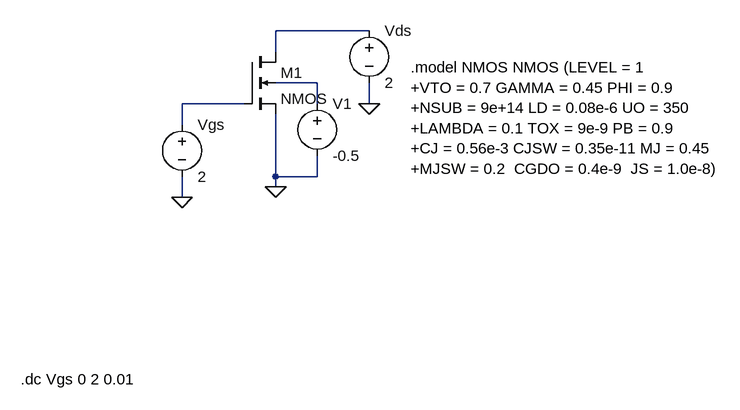
[diagram p0: schematic nmos load char.asc]
nmos load char.asc, the LTspice schematic file:
Version 4
SHEET 1 1212 744
WIRE 640 48 496 48
WIRE 496 80 496 48
WIRE 560 128 496 128
WIRE 448 160 352 160
WIRE 560 160 560 128
WIRE 640 160 640 128
WIRE 352 192 352 160
WIRE 496 272 496 176
WIRE 560 272 560 240
WIRE 560 272 496 272
WIRE 496 288 496 272
WIRE 352 304 352 272
FLAG 640 160 0
FLAG 496 288 0
FLAG 352 304 0
SYMBOL voltage 640 32 R0
WINDOW 123 0 0 Left 0
WINDOW 39 0 0 Left 0
SYMATTR InstName Vds
SYMATTR Value 2
SYMBOL voltage 352 176 R0
WINDOW 123 0 0 Left 0
WINDOW 39 0 0 Left 0
SYMATTR InstName Vgs
SYMATTR Value 2
SYMBOL nmos4 448 80 R0
SYMATTR InstName M1
SYMATTR Value2 l=200n w=200n
SYMBOL voltage 560 144 R0
WINDOW 123 0 0 Left 0
WINDOW 39 0 0 Left 0
SYMATTR InstName V1
SYMATTR Value -0.5
TEXT 104 584 Left 2 !.dc Vgs 0 2 0.01
TEXT 704 104 Left 2 !.model NMOS NMOS (LEVEL = 1 \n+VTO = 0.7 GAMMA = 0.45 PHI = 0.9\n+NSUB = 9e+14 LD = 0.08e-6 UO = 350 \n+LAMBDA = 0.1 TOX = 9e-9 PB = 0.9 \n+CJ = 0.56e-3 CJSW = 0.35e-11 MJ = 0.45 \n+MJSW = 0.2  CGDO = 0.4e-9  JS = 1.0e-8)

The netlist it stands for:
* nmos load char.asc
Vds N001 0 2
Vgs N003 0 2
M1 N001 N003 0 N002 NMOS l=200n w=200n
V1 N002 0 -0.5
.model NMOS NMOS
.model PMOS PMOS
.lib standard.mos
.dc Vgs 0 2 0.01
.model NMOS NMOS (LEVEL = 1
+VTO = 0.7 GAMMA = 0.45 PHI = 0.9
+NSUB = 9e+14 LD = 0.08e-6 UO = 350
+LAMBDA = 0.1 TOX = 9e-9 PB = 0.9
+CJ = 0.56e-3 CJSW = 0.35e-11 MJ = 0.45
+MJSW = 0.2  CGDO = 0.4e-9  JS = 1.0e-8)
.backanno
.end